# Altium schematic sheet Sensor_ExpandBoard_Connection.SchDoc: Sensor Card
size A4; Revision: V1.1; SheetNumber: 7; SheetTotal: 7; Function: Connector
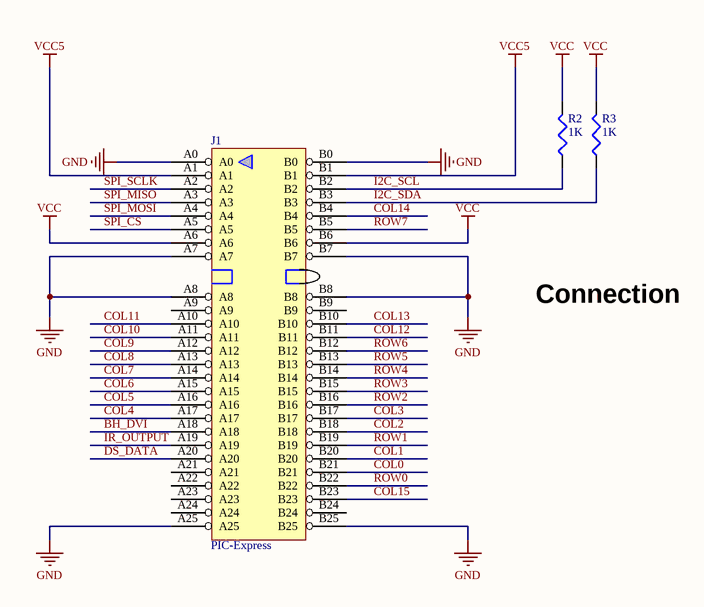
[diagram p0: Sensor_ExpandBoard_Connection.SchDoc]

## Parts
J1  PIC-Express  [PICE-M]
R2  1K  [R0603]
R3  1K  [R0603]

## Nets
GND: J1.A0 J1.A7 J1.A8 J1.A25 J1.B0 J1.B7 J1.B8 J1.B25
VCC: J1.A6 J1.B6 R2.2 R3.2
VCC5: J1.A1 J1.B1
BH_DVI: J1.A18
COL0: J1.B21
COL1: J1.B20
COL2: J1.B18
COL3: J1.B17
COL4: J1.A17
COL5: J1.A16
COL6: J1.A15
COL7: J1.A14
COL8: J1.A13
COL9: J1.A12
COL10: J1.A11
COL11: J1.A10
COL12: J1.B11
COL13: J1.B10
COL14: J1.B4
COL15: J1.B23
DS_DATA: J1.A20
I2C_SCL: J1.B2 R2.1
I2C_SDA: J1.B3 R3.1
IR_OUTPUT: J1.A19
ROW0: J1.B22
ROW1: J1.B19
ROW2: J1.B16
ROW3: J1.B15
ROW4: J1.B14
ROW5: J1.B13
ROW6: J1.B12
ROW7: J1.B5
SPI_~{CS}: J1.A5
SPI_MISO: J1.A3
SPI_MOSI: J1.A4
SPI_SCLK: J1.A2

Not connected (* = marked no-connect by the designer): J1 A9 A21 A22 A23 A24 B9 B24

## Notes on the sheet
- Connection
- 工程名称：
- 图纸大小：
- 日期：
- A4
- 版本号：
- 页码：
- 第
- 共
- 制图：
- 审核：

## Library data of the parts
R2 R3 = Res: Resistor; Published: 8-Jun-2000; LatestRevisionDate: 29-May-2009; LatestRevisionNote: IPC-7351 Footprint Added.; PackageReference: J1-0603; Publisher: Altium Limited; PackageDescription: Chip Resistor; Value: 1K
J1 = PIC-Express: Pins: 52; Value: PIC-Express